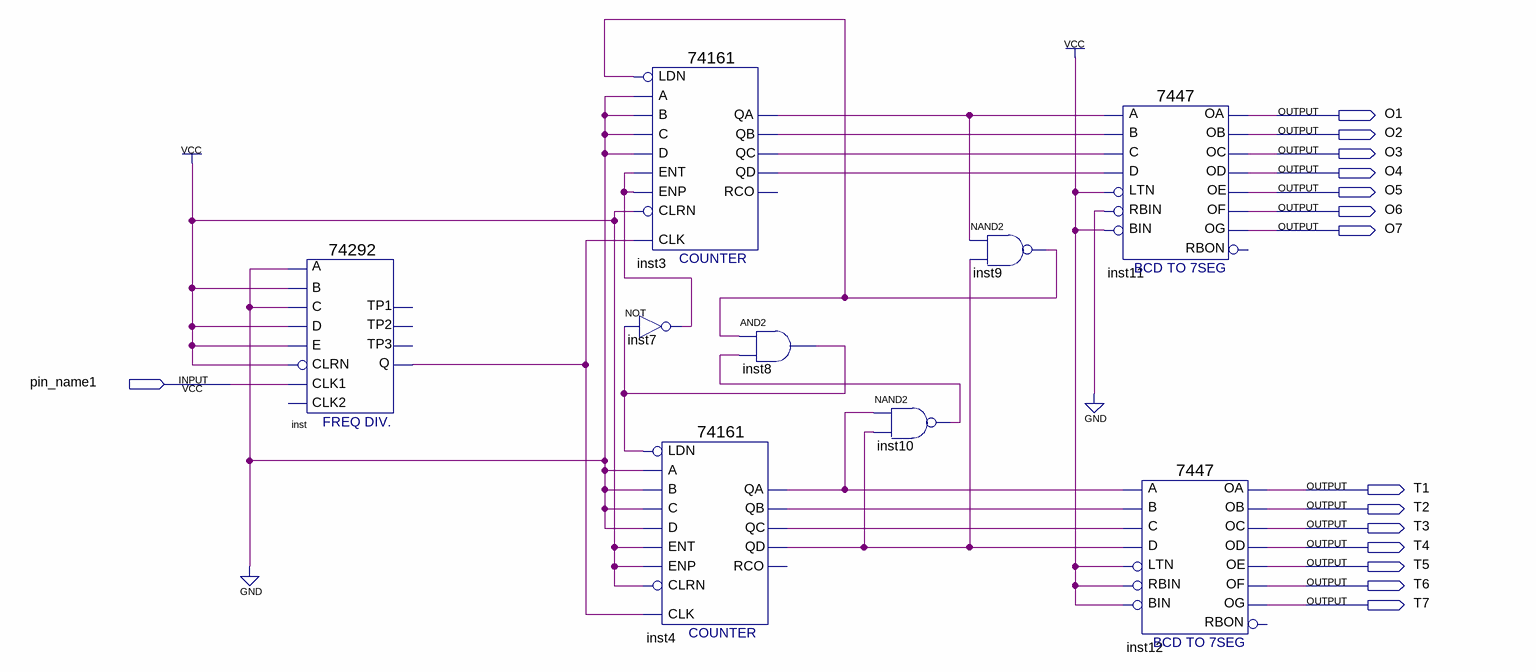
[diagram p0: schematic sheet]
// Quartus schematic Block1.bdf as structural Verilog: 9 symbols, 15 pins
module Block1 (
  input  pin_name1,
  output O1,
  output O2,
  output O3,
  output O4,
  output O5,
  output O6,
  output O7,
  output T1,
  output T2,
  output T3,
  output T4,
  output T5,
  output T6,
  output T7
);

  wire inst3_qa, inst3_qb, inst3_qc, inst3_qd, inst4_qa, inst4_qb, inst4_qc, inst4_qd, inst7_out, inst8_out,
       inst9_out, inst10_out, inst_q;

  \74292  inst (
    .A(1'b0), .D(1'b1), .C(1'b0), .B(1'b1), .CLK1(pin_name1), .CLRN(1'b1), .E(1'b1), .Q(inst_q));  // open: CLK2, TP2, TP1, TP3
  \74161  inst3 (
    .CLRN(1'b1), .CLK(inst_q), .ENP(inst7_out), .LDN(inst9_out), .A(1'b0), .D(1'b0), .ENT(inst7_out),
    .B(1'b0), .C(1'b0), .QD(inst3_qd), .QC(inst3_qc), .QB(inst3_qb), .QA(inst3_qa));  // open: RCO
  not inst7 (inst7_out, inst8_out);
  \74161  inst4 (
    .CLRN(1'b1), .CLK(inst_q), .ENP(1'b1), .LDN(inst8_out), .A(1'b0), .D(1'b0), .ENT(1'b1), .B(1'b0),
    .C(1'b0), .QD(inst4_qd), .QC(inst4_qc), .QB(inst4_qb), .QA(inst4_qa));  // open: RCO
  and inst8 (inst8_out, inst9_out, inst10_out);
  nand inst10 (inst10_out, inst4_qa, inst4_qd);
  nand inst9 (inst9_out, inst3_qa, inst4_qd);
  \7447  inst11 (
    .LTN(1'b1), .B(inst3_qb), .C(inst3_qc), .D(inst3_qd), .RBIN(1'b0), .BIN(1'b1), .A(inst3_qa), .OB(O2),
    .OC(O3), .OE(O5), .OD(O4), .OF(O6), .OG(O7), .OA(O1));  // open: RBON
  \7447  inst12 (
    .LTN(1'b1), .B(inst4_qb), .C(inst4_qc), .D(inst4_qd), .RBIN(1'b1), .BIN(1'b1), .A(inst4_qa), .OB(T2),
    .OC(T3), .OE(T5), .OD(T4), .OF(T6), .OG(T7), .OA(T1));  // open: RBON
endmodule
